# Altium schematic sheet controller.SchDoc
size B; SheetNumber: 3
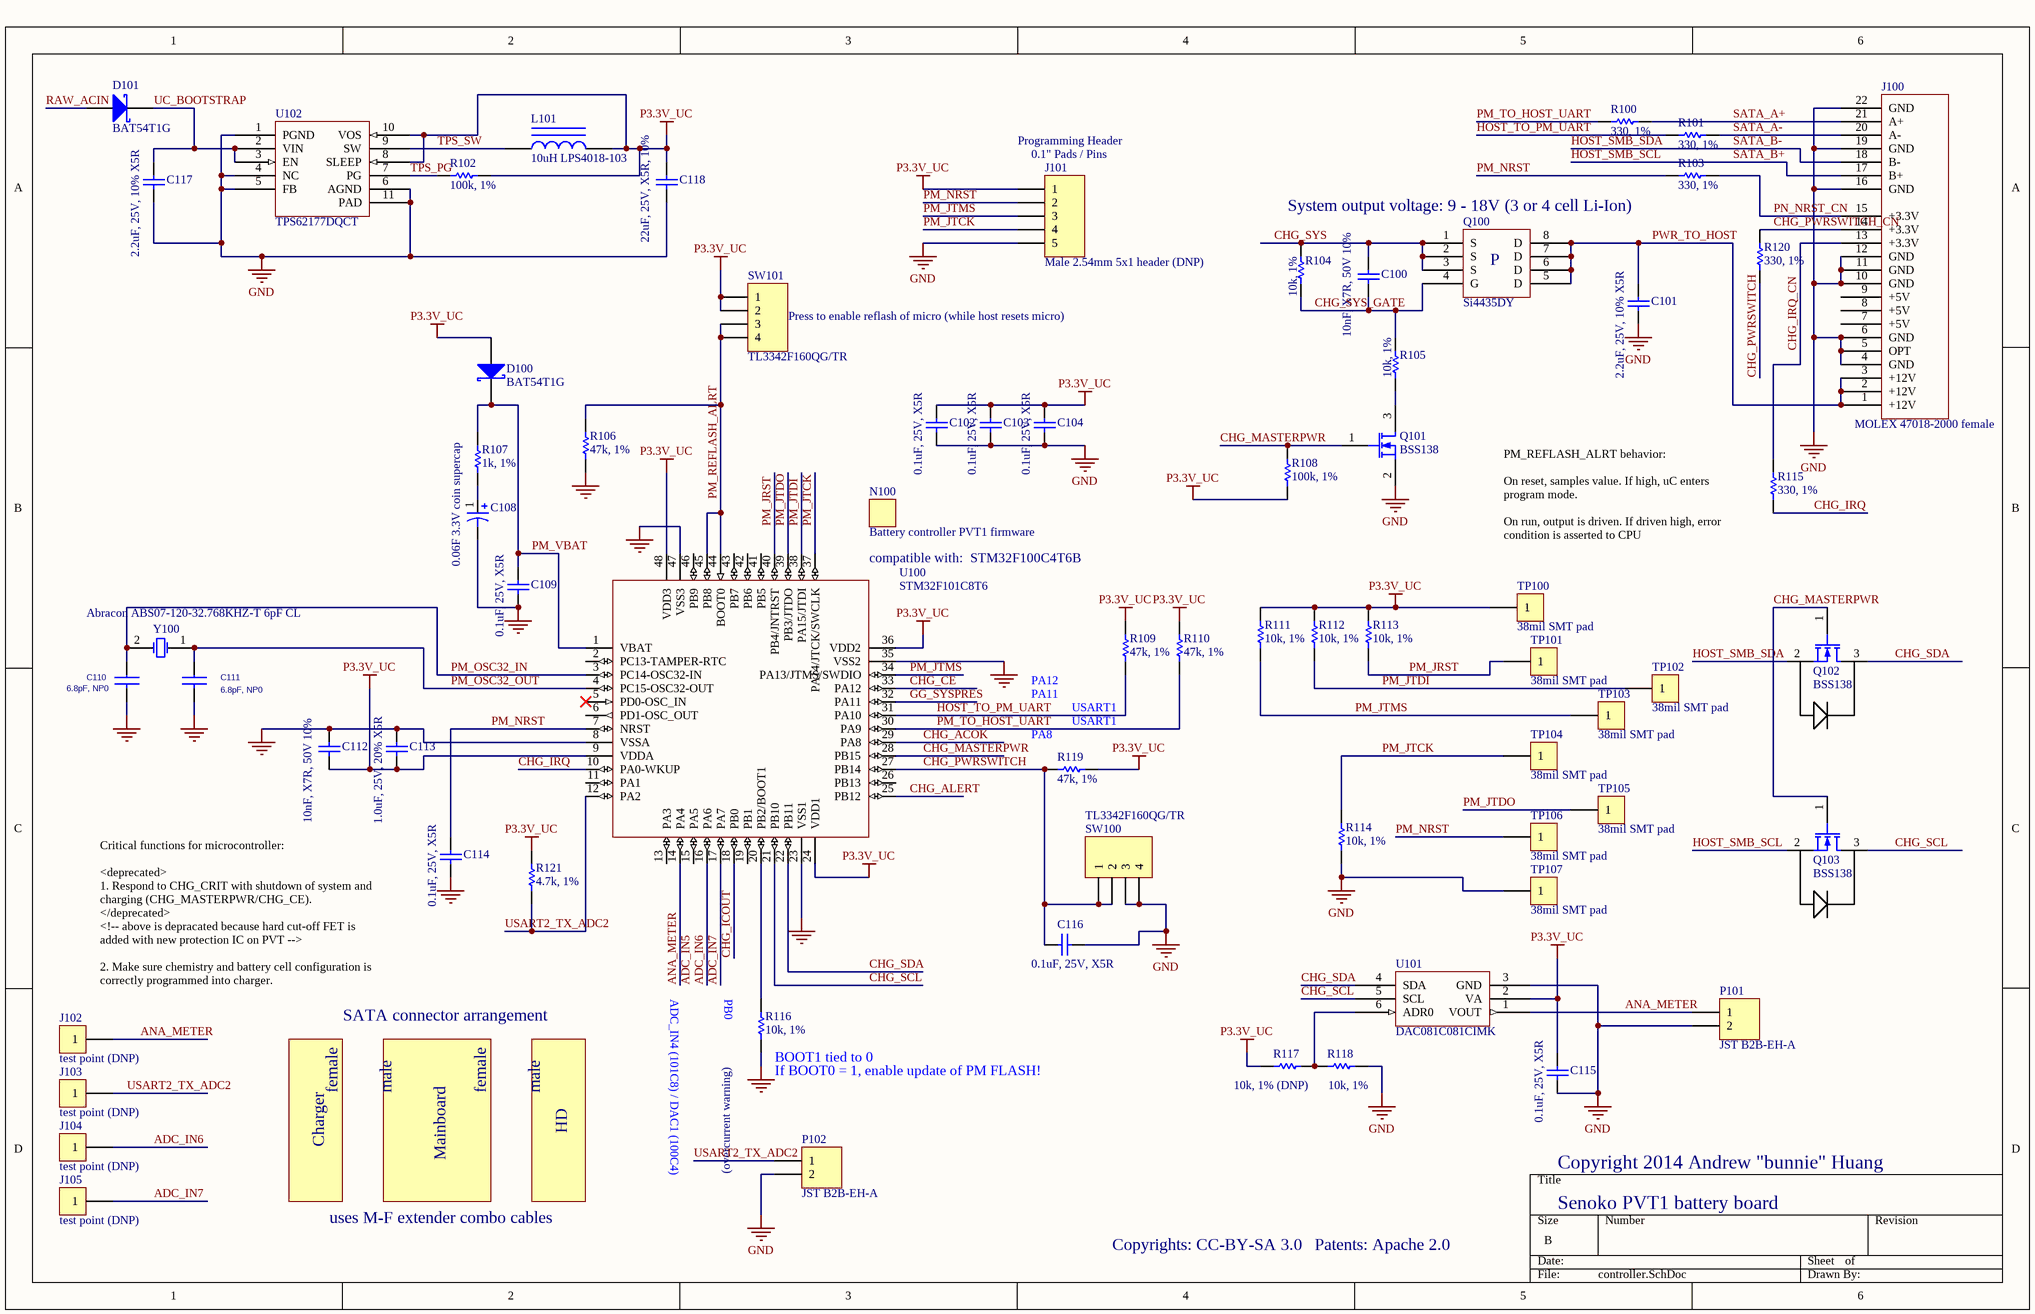
[diagram p0: controller.SchDoc]

## Parts
C100  10nF, X7R, 50V 10%  [CAPC1005N]
C101  2.2uF, 25V, 10% X5R  [CAPC1608N]
C102  0.1uF, 25V, X5R  [CAPC1005N]
C103  0.1uF, 25V, X5R  [CAPC1005N]
C104  0.1uF, 25V, X5R  [CAPC1005N]
C108  0.06F 3.3V coin supercap  [TAIYO_YUDEN_PAS414HR-VA5R]
C109  0.1uF, 25V, X5R  [CAPC1005N]
C110  6.8pF, NP0  [CAPC1005N]
C111  6.8pF, NP0  [CAPC1005N]
C112  10nF, X7R, 50V 10%  [CAPC1005N]
C113  1.0uF, 25V, 20% X5R  [CAPC1608N]
C114  0.1uF, 25V, X5R  [CAPC1005N]
C115  0.1uF, 25V, X5R  [CAPC1005N]
C116  0.1uF, 25V, X5R  [CAPC1005N]
C117  2.2uF, 25V, 10% X5R  [CAPC1608N]
C118  22uF, 25V, X5R, 10%  [CAPC3225N]
D100  BAT54T1G  [SOD123]
D101  BAT54T1G  [SOD123]
J100  MOLEX 47018-2000 female  [SATA_MOLEX_47018_2000]
J101  Male 2.54mm 5x1 header (DNP)  [HDR1X5]
J102  test point (DNP)  [TP_SMT_38mil]
J103  test point (DNP)  [TP_SMT_38mil]
J104  test point (DNP)  [TP_SMT_38mil]
J105  test point (DNP)  [TP_SMT_38mil]
L101  10uH LPS4018-103  [COILCRAFT_LPS4018]
N100  Battery controller PVT1 firmware
P101  JST B2B-EH-A  [JST_B2B_EH_A]
P102  JST B2B-EH-A  [JST_B2B_EH_A]
Q100  Si4435DY  [SOIC127P600-8AN]
Q101  BSS138  [SOT23-3N]
Q102  BSS138  [SOT23-3N]
Q103  BSS138  [SOT23-3N]
R100  330, 1%  [RESC1005N]
R101  330, 1%  [RESC1005N]
R102  100k, 1%  [RESC1005N]
R103  330, 1%  [RESC1005N]
R104  10k, 1%  [RESC1005N]
R105  10k, 1%  [RESC1005N]
R106  47k, 1%  [RESC1005N]
R107  1k, 1%  [RESC1005N]
R108  100k, 1%  [RESC1005N]
R109  47k, 1%  [RESC1005N]
R110  47k, 1%  [RESC1005N]
R111  10k, 1%  [RESC1005N]
R112  10k, 1%  [RESC1005N]
R113  10k, 1%  [RESC1005N]
R114  10k, 1%  [RESC1005N]
R115  330, 1%  [RESC1005N]
R116  10k, 1%  [RESC1005N]
R117  10k, 1% (DNP)  [RESC1005N]
R118  10k, 1%  [RESC1005N]
R119  47k, 1%  [RESC1005N]
R120  330, 1%  [RESC1005N]
R121  4.7k, 1%  [RESC1005N]
SW100  TL3342F160QG/TR  [SWITCH_TS-1187A]
SW101  TL3342F160QG/TR  [SWITCH_TS-1187A]
TP100  38mil SMT pad  [TP_SMT_38mil]
TP101  38mil SMT pad  [TP_SMT_38mil]
TP102  38mil SMT pad  [TP_SMT_38mil]
TP103  38mil SMT pad  [TP_SMT_38mil]
TP104  38mil SMT pad  [TP_SMT_38mil]
TP105  38mil SMT pad  [TP_SMT_38mil]
TP106  38mil SMT pad  [TP_SMT_38mil]
TP107  38mil SMT pad  [TP_SMT_38mil]
U100  STM32F101C8T6  [TSQFP50P900X900-48N]
U101  DAC081C081CIMK  [SOT26A-6N]
U102  TPS62177DQCT  [TI_DQC_R_PWSON_N10]
Y100  Abracon ABS07-120-32.768KHZ-T 6pF CL  [ABS07-120]

## Nets
GND: C101.2 C102.2 C103.2 C104.2 C108.2 C109.2 C110.2 C111.2 C112.1 C113.1 C114.2 C115.2 C116.1 C117.2 C118.2 J100.4(GND) J100.5(OPT) J100.6(GND) J100.10(GND) J100.11(GND) J100.12(GND) J100.16(GND) J100.19(GND) J100.22(GND) J101.5 P101.2 P102.2 Q101.2(S) R106.1 R114.1 R116.1 R118.2 SW100.3 SW100.4 TP107.1 U100.8(VSSA) U100.23(VSS1) U100.35(VSS2) U100.47(VSS3) U101.3(GND) U102.1(PGND) U102.4(NC) U102.5(FB) U102.6(AGND) U102.11(PAD)
P3.3V_UC: C102.1 C103.1 C104.1 C112.2 C113.2 C115.1 C118.1 D100.1(A) J101.1 L101.2 R102.1 R108.1 R109.2 R110.2 R111.2 R112.2 R113.2 R117.1 R119.2 R121.2 SW101.1 SW101.2 TP100.1 U100.9(VDDA) U100.24(VDD1) U100.36(VDD2) U100.48(VDD3) U101.2(VA) U102.8(SLEEP) U102.10(VOS)
ADC_IN6: J104.1 U100.16(PA6)
ADC_IN7: J105.1 U100.17(PA7)
ANA_METER: J102.1 P101.1 U100.14(PA4) U101.1(VOUT)
CHG_ACOK: U100.29(PA8)
CHG_ALERT: U100.25(PB12)
CHG_CE: U100.33(PA12)
CHG_ICOUT: U100.18(PB0)
CHG_IRQ: R115.1 U100.10(PA0-WKUP)
CHG_IRQ_CN: J100.13(+3.3V) R115.2
CHG_MASTERPWR: Q101.1(G) Q102.1(G) Q103.1(G) R108.2 U100.28(PB15)
CHG_PWRSWITCH: C116.2 R119.1 R120.1 SW100.1 SW100.2 U100.27(PB14)
CHG_PWRSWITCH_CN: J100.14(+3.3V) R120.2
CHG_SCL: Q103.3(D) U100.21(PB10) U101.5(SCL)
CHG_SDA: Q102.3(D) U100.22(PB11) U101.4(SDA)
CHG_SYS: C100.1 Q100.1(S) Q100.2(S) Q100.3(S) R104.2
CHG_SYS_GATE: C100.2 Q100.4(G) R104.1 R105.2
GG_SYSPRES: U100.32(PA11)
HOST_SMB_SCL: J100.17(B+) Q103.2(S)  [also labelled SATA_B+]
HOST_SMB_SDA: J100.18(B-) Q102.2(S)  [also labelled SATA_B-]
HOST_TO_PM_UART: R101.1 R109.1 U100.31(PA10)
PM_JRST: R113.1 TP101.1 U100.40(PB4/JNTRST)
PM_JTCK: J101.4 R114.2 TP104.1 U100.37(PA14/JTCK/SWCLK)
PM_JTDI: R112.1 TP102.1 U100.38(PA15/JTDI)
PM_JTDO: TP105.1 U100.39(PB3/JTDO)
PM_JTMS: J101.3 R111.1 TP103.1 U100.34(PA13/JTMS/SWDIO)
PM_NRST: C114.1 J101.2 R103.1 TP106.1 U100.7(NRST)
PM_OSC32_IN: C110.1 U100.3(PC14-OSC32-IN) Y100.2(OSC2)
PM_OSC32_OUT: C111.1 U100.4(PC15-OSC32-OUT) Y100.1(OSC1)
PM_REFLASH_ALRT: R106.2 SW101.3 SW101.4 U100.44(BOOT0) U100.45(PB8)
PM_TO_HOST_UART: R100.1 R110.1 U100.30(PA9)
PM_VBAT: C109.1 D100.2(K) R107.2 U100.1(VBAT)
PN_NRST_CN: J100.15(+3.3V) R103.2
PWR_TO_HOST: C101.1 J100.1(+12V) J100.2(+12V) J100.3(+12V) Q100.5(D) Q100.6(D) Q100.7(D) Q100.8(D)
RAW_ACIN: D101.1(A)
SATA_A+: J100.21(A+) R100.2
SATA_A-: J100.20(A-) R101.2
TPS_PG: R102.2 U102.7(PG)
TPS_SW: L101.1 U102.9(SW)
UC_BOOTSTRAP: C117.1 D101.2(K) U102.2(VIN) U102.3(EN)
USART2_TX_ADC2: J103.1 P102.1 R121.1 U100.12(PA2)
NetC108_1: C108.1 R107.1
NetQ101_3: Q101.3(D) R105.1
NetR116_2: R116.2 U100.20(PB2/BOOT1)
NetR117_2: R117.2 R118.1 U101.6(ADR0)

Not connected (* = marked no-connect by the designer): J100 7(+5V) 8(+5V) 9(+5V); U100 2(PC13-TAMPER-RTC) 5(PD0-OSC_IN)* 6(PD1-OSC_OUT) 11(PA1) 13(PA3) 15(PA5) 19(PB1) 26(PB13) 41(PB5) 42(PB6) 43(PB7) 46(PB9)

## Notes on the sheet
- (near J101) Programming Header
- (near J101) 0.1" Pads / Pins
- System output voltage: 9 - 18V (3 or 4 cell Li-Ion)
- (near SW101) Press to enable reflash of micro (while host resets micro)
- (near U100) compatible with:  STM32F100C4T6B
- (near TP100) PM_REFLASH_ALRT behavior:
  On reset, samples value. If high, uC enters program mode.
  On run, output is driven. If driven high, error condition is asserted to CPU
- PA11
- PA12
- USART1
- (near R119) PA8
- Critical functions for microcontroller:
  <deprecated>
  1. Respond to CHG_CRIT with shutdown of system and charging (CHG_MASTERPWR/CHG_CE).
  </deprecated>
  <!-- above is depracated because hard cut-off FET is added with new protection IC on PVT -->
  2. Make sure chemistry and battery cell configuration is correctly programmed into charger.
- ADC_IN4 (101C8) / DAC1 (100C4)
- (near R116) PB0
- SATA connector arrangement
- (near R116) BOOT1 tied to 0
- female
- male
- HD
- (near R116) If BOOT0 = 1, enable update of PM FLASH!
- Charger
- Mainboard
- (near R116) (overcurrent warning)
- Copyright 2014 Andrew "bunnie" Huang
- uses M-F extender combo cables
- Copyrights: CC-BY-SA 3.0
- Patents: Apache 2.0
- Senoko PVT1 battery board
- Labels drawn without touching a wire or pin: ADC_IN5
- (in symbol Si4435DY) P

## Library data of the parts
C100-C104 C109 C112-C118 = Cap Semi: Capacitor (Semiconductor SIM Model)
  C100-C104 C109 C112-C114 C116-C118: Published: 8-Jun-2000; LatestRevisionDate: 17-Jul-2002; LatestRevisionNote: Re-released for DXP Platform.; PackageReference: C1206; Publisher: Altium Limited
C108 = Cap Pol3: Taiyo Yuden PAS414HR-VA5R; Published: 8-Jun-2000; LatestRevisionDate: 17-Jul-2002; LatestRevisionNote: Re-released for DXP Platform.; PackageReference: C0805; Publisher: Altium Limited
C110 C111 = CAP NP: Right: 20; Bottom: 10
D100 D101 = D Schottky: Schottky Diode; Code - JEDEC: DO-214-AA; Published: 8-Jun-2000; Publisher: Altium Limited; Revision: July-2002: Re-released for DXP Platform.
J100 = SATA_22P_HEADER: SATA+Power connector
J101 = Header 5: Header, 5-Pin; LatestRevisionDate: 17-Jul-2002; LatestRevisionNote: Re-released for DXP Platform.; Publisher: Altium Limited
J102-J105 TP100-TP107 = CON1: Connector
L101 = Inductor Iron: Magnetic-Core Inductor; Published: 24-Mar-1999; LatestRevisionDate: 17-Jul-2002; LatestRevisionNote: Re-released for DXP Platform.; PackageReference: AXIAL-0.9; Publisher: Altium Limited
N100 = NOTE: Placeholder for non-electrical BOM items
P101 P102 = Header 2: Header, 2-Pin; LatestRevisionDate: 17-Jul-2002; LatestRevisionNote: Re-released for DXP Platform.; Publisher: Altium Limited
Q100 = Si4435DY: Singre P-channel FET, 8A, 30V
Q101-Q103 = MOSFET-N: N-Channel MOSFET; Published: 8-Jun-2000; LatestRevisionDate: 17-Jul-2002; LatestRevisionNote: Re-released for DXP Platform.; PackageVersion: 1995/1996; PackageReference: E3; Publisher: Altium Limited
R100 R101 R103-R107 R109-R121 = Res1: Resistor; Value: 100k; Published: 8-Jun-2000; LatestRevisionDate: 17-Jul-2002; LatestRevisionNote: Re-released for DXP Platform.; PackageReference: AXIAL-0.3; Publisher: Altium Limited
R102 R108 = Res1: Resistor; Published: 8-Jun-2000; LatestRevisionDate: 17-Jul-2002; LatestRevisionNote: Re-released for DXP Platform.; PackageReference: AXIAL-0.3; Publisher: Altium Limited; Value: 100k
SW100 SW101 = Header 4: Chi Fung TS-1187A; LatestRevisionDate: 17-Jul-2002; LatestRevisionNote: Re-released for DXP Platform.; Publisher: Altium Limited
U100 = STM32F103C8T6: 32-bit ARM Coretex high performance microcontroller
U101 = DAC081C81CIMK: Single 8-bit DAC for I2C bus
U102 = TPS62177DQCT: 28V, 0.5A step-down converter with sleep mode
Y100 = XTAL: Crystal Oscillator; Published: 8-Jun-2000; LatestRevisionDate: 17-Jul-2002; LatestRevisionNote: Re-released for DXP Platform.; PackageReference: R38; Publisher: Altium Limited